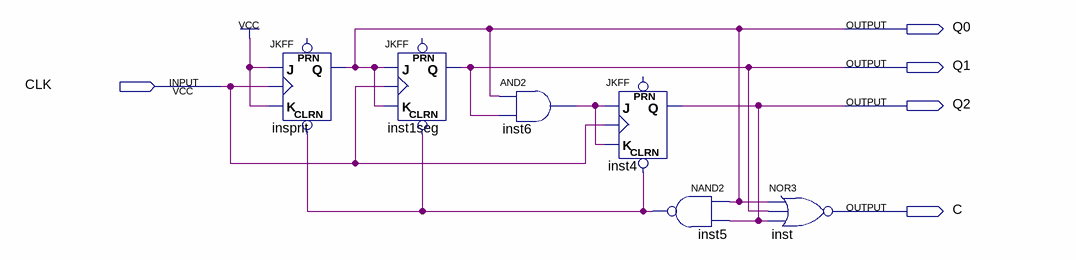
[diagram p0: schematic sheet]
// Quartus schematic DiagCont5.bdf as structural Verilog: 6 symbols, 5 pins
module DiagCont5 (
  input  CLK,
  output Q0,
  output Q1,
  output Q2,
  output C
);

  wire inst5_out, inst6_out;

  JKFF insprit (.CLRN(inst5_out), .K(1'b1), .J(1'b1), .CLK(CLK), .Q(Q0));  // open: PRN
  JKFF inst1seg (.CLRN(inst5_out), .K(Q0), .J(Q0), .CLK(CLK), .Q(Q1));  // open: PRN
  and inst6 (inst6_out, Q0, Q1);
  JKFF inst4 (.CLRN(inst5_out), .K(inst6_out), .J(inst6_out), .CLK(CLK), .Q(Q2));  // open: PRN
  nand inst5 (inst5_out, Q0, Q2);
  nor inst (C, Q0, Q1, Q2);
endmodule
